# Altium schematic sheet Curiosity_Nano_Base_for_Clicks_Revision_History.SchDoc: Revision History
size A3; Organization: Microchip Technology Norway; Address1: Brøsetvegen 164; Address2: 7069 Trondheim; Address3: NORWAY; SheetNumber: 3; SheetTotal: 3; DrawnBy: T.Frostad; Engineer: T.Frostad; PageSetup: Record=PageOptions|CenterHorizontal=True|CenterVertical=True|PrintScale=1.01|XCorrection=1.00|YCorrection=1.00|PrintKind=1|BorderSize=5000000|LeftOffset=0|BottomOffset=0|Orientation=2|PaperLength=1000|PaperWidth=1000|Scale=100|PaperSource=7|PrintQuality=-4|MediaType=1|DitherType=10|PaperKind=A3 (297 x 420 mm)|PrintScaleMode=1; ProjectTitle: Curiosity Nano Base for Click boards; ProjectName: Curiosity Nano
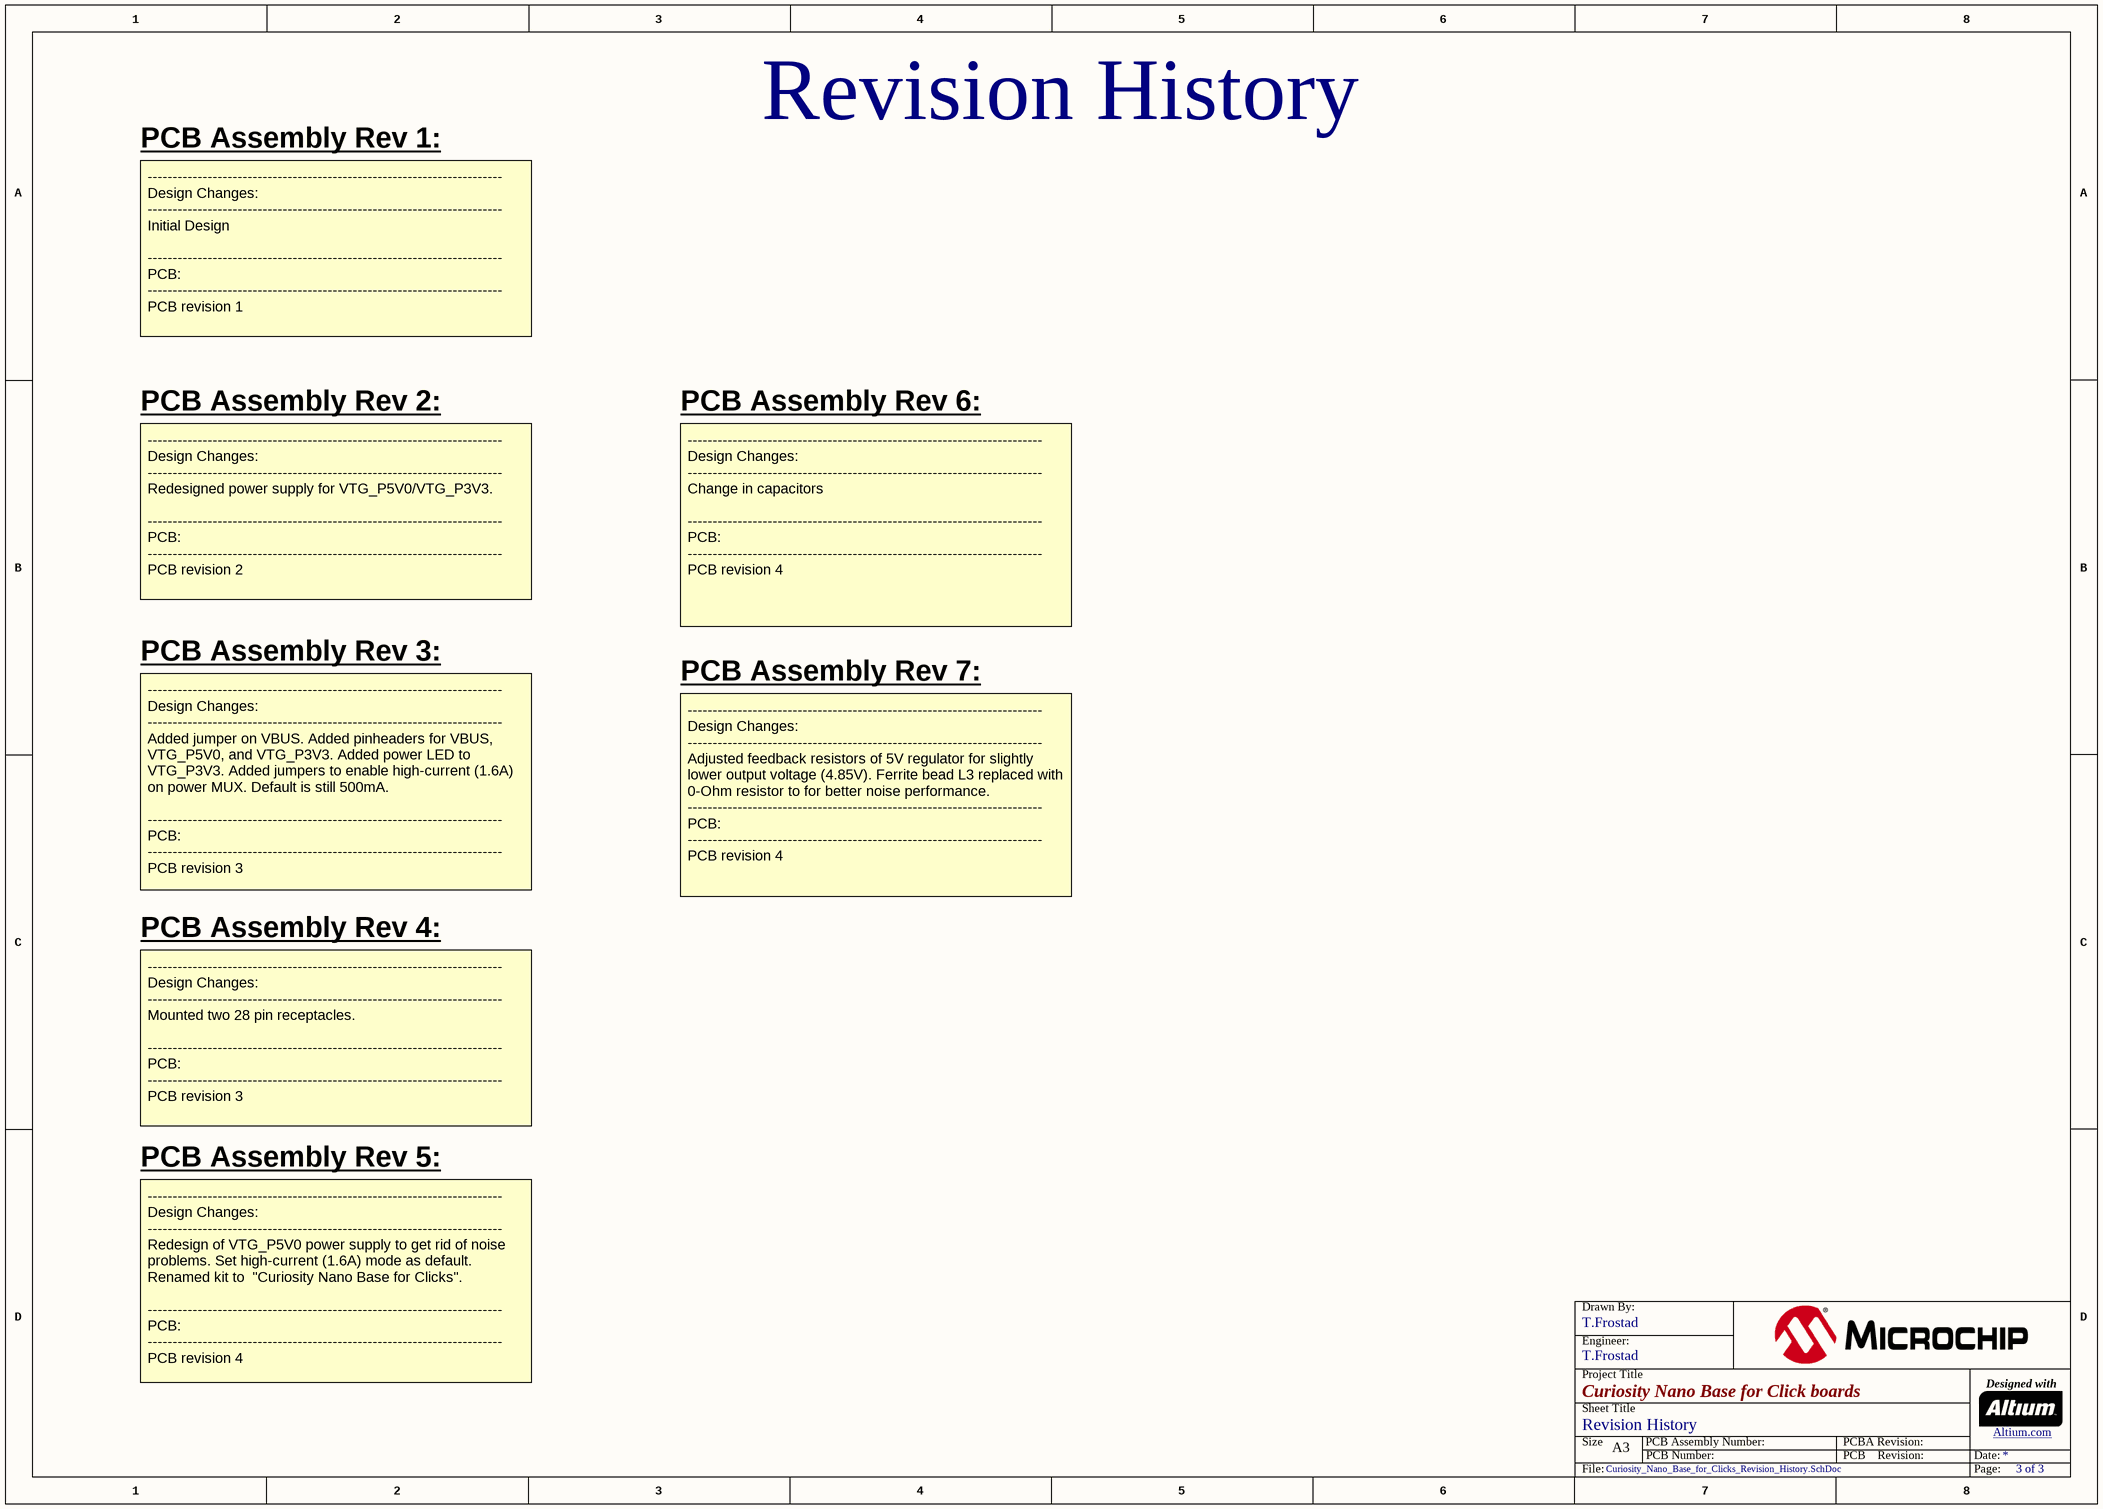
[diagram p0: Curiosity_Nano_Base_for_Clicks_Revision_History.SchDoc]

## Notes on the sheet
- PCB Assembly Rev 1:
- Revision History
- -----------------------------------------------------------------------
  Design Changes:
  -----------------------------------------------------------------------
  Initial Design
  -----------------------------------------------------------------------
  PCB:
  -----------------------------------------------------------------------
  PCB revision 1
- PCB Assembly Rev 2:
- PCB Assembly Rev 6:
- -----------------------------------------------------------------------
  Design Changes:
  -----------------------------------------------------------------------
  Redesigned power supply for VTG_P5V0/VTG_P3V3.
  -----------------------------------------------------------------------
  PCB:
  -----------------------------------------------------------------------
  PCB revision 2
- -----------------------------------------------------------------------
  Design Changes:
  -----------------------------------------------------------------------
  Change in capacitors
  -----------------------------------------------------------------------
  PCB:
  -----------------------------------------------------------------------
  PCB revision 4
- PCB Assembly Rev 3:
- PCB Assembly Rev 7:
- -----------------------------------------------------------------------
  Design Changes:
  -----------------------------------------------------------------------
  Added jumper on VBUS. Added pinheaders for VBUS, VTG_P5V0, and VTG_P3V3. Added power LED to VTG_P3V3. Added jumpers to enable high-current (1.6A) on power MUX. Default is still 500mA.
  -----------------------------------------------------------------------
  PCB:
  -----------------------------------------------------------------------
  PCB revision 3
- -----------------------------------------------------------------------
  Design Changes:
  -----------------------------------------------------------------------
  Adjusted feedback resistors of 5V regulator for slightly lower output voltage (4.85V). Ferrite bead L3 replaced with 0-Ohm resistor to for better noise performance.
  -----------------------------------------------------------------------
  PCB:
  -----------------------------------------------------------------------
  PCB revision 4
- PCB Assembly Rev 4:
- -----------------------------------------------------------------------
  Design Changes:
  -----------------------------------------------------------------------
  Mounted two 28 pin receptacles.
  -----------------------------------------------------------------------
  PCB:
  -----------------------------------------------------------------------
  PCB revision 3
- PCB Assembly Rev 5:
- -----------------------------------------------------------------------
  Design Changes:
  -----------------------------------------------------------------------
  Redesign of VTG_P5V0 power supply to get rid of noise problems. Set high-current (1.6A) mode as default. Renamed kit to  "Curiosity Nano Base for Clicks".
  -----------------------------------------------------------------------
  PCB:
  -----------------------------------------------------------------------
  PCB revision 4
- Drawn By:
- Project Title
- Engineer:
- Designed with
- Sheet Title
- Size
- A3
- PCB Number:
- PCB Assembly Number:
- PCBA Revision:
- PCB    Revision:
- Date:
- Altium.com <http://go.altium.com/MicrochipLandingPage_Evaluation.html>
- File:
- Page: